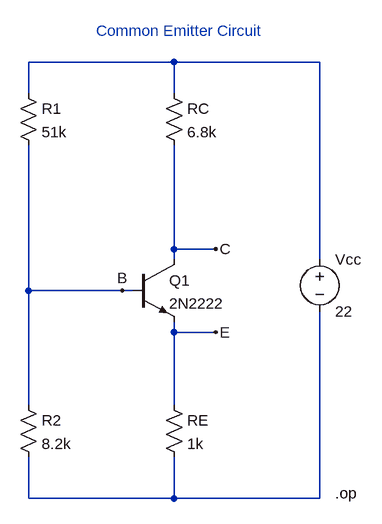
[diagram p0: schematic 2EEB_VELASCO_EXPT7_CKT1.asc]
2EEB_VELASCO_EXPT7_CKT1.asc, the LTspice schematic file:
Version 4
SHEET 1 880 680
WIRE 352 0 128 0
WIRE 576 0 352 0
WIRE 128 48 128 0
WIRE 352 48 352 0
WIRE 352 288 352 128
WIRE 416 288 352 288
WIRE 352 304 352 288
WIRE 576 304 576 0
WIRE 128 352 128 128
WIRE 272 352 128 352
WIRE 288 352 272 352
WIRE 352 416 352 400
WIRE 416 416 352 416
WIRE 128 528 128 352
WIRE 352 528 352 416
WIRE 128 672 128 608
WIRE 352 672 352 608
WIRE 352 672 128 672
WIRE 576 672 576 384
WIRE 576 672 352 672
FLAG 272 352 B
FLAG 416 288 C
FLAG 416 416 E
SYMBOL res 112 32 R0
SYMATTR InstName R1
SYMATTR Value 51k
SYMBOL res 336 32 R0
SYMATTR InstName RC
SYMATTR Value 6.8k
SYMBOL npn 288 304 R0
SYMATTR InstName Q1
SYMATTR Value 2N2222
SYMBOL res 336 512 R0
SYMATTR InstName RE
SYMATTR Value 1k
SYMBOL res 112 512 R0
SYMATTR InstName R2
SYMATTR Value 8.2k
SYMBOL voltage 576 288 R0
SYMATTR InstName Vcc
SYMATTR Value 22
TEXT 232 -48 Left 2 ;Common Emitter Circuit
TEXT 600 664 Left 2 !.op

The netlist it stands for:
* 2EEB_VELASCO_EXPT7_CKT1.asc
R1 N001 B 51k
RC N001 C 6.8k
Q1 C B E 0 2N2222
RE E N002 1k
R2 B N002 8.2k
Vcc N001 N002 22
.model NPN NPN
.model PNP PNP
.lib standard.bjt
* Common Emitter Circuit
.op
.backanno
.end